# EAGLE schematic controller (EAGLE 6.5.0)
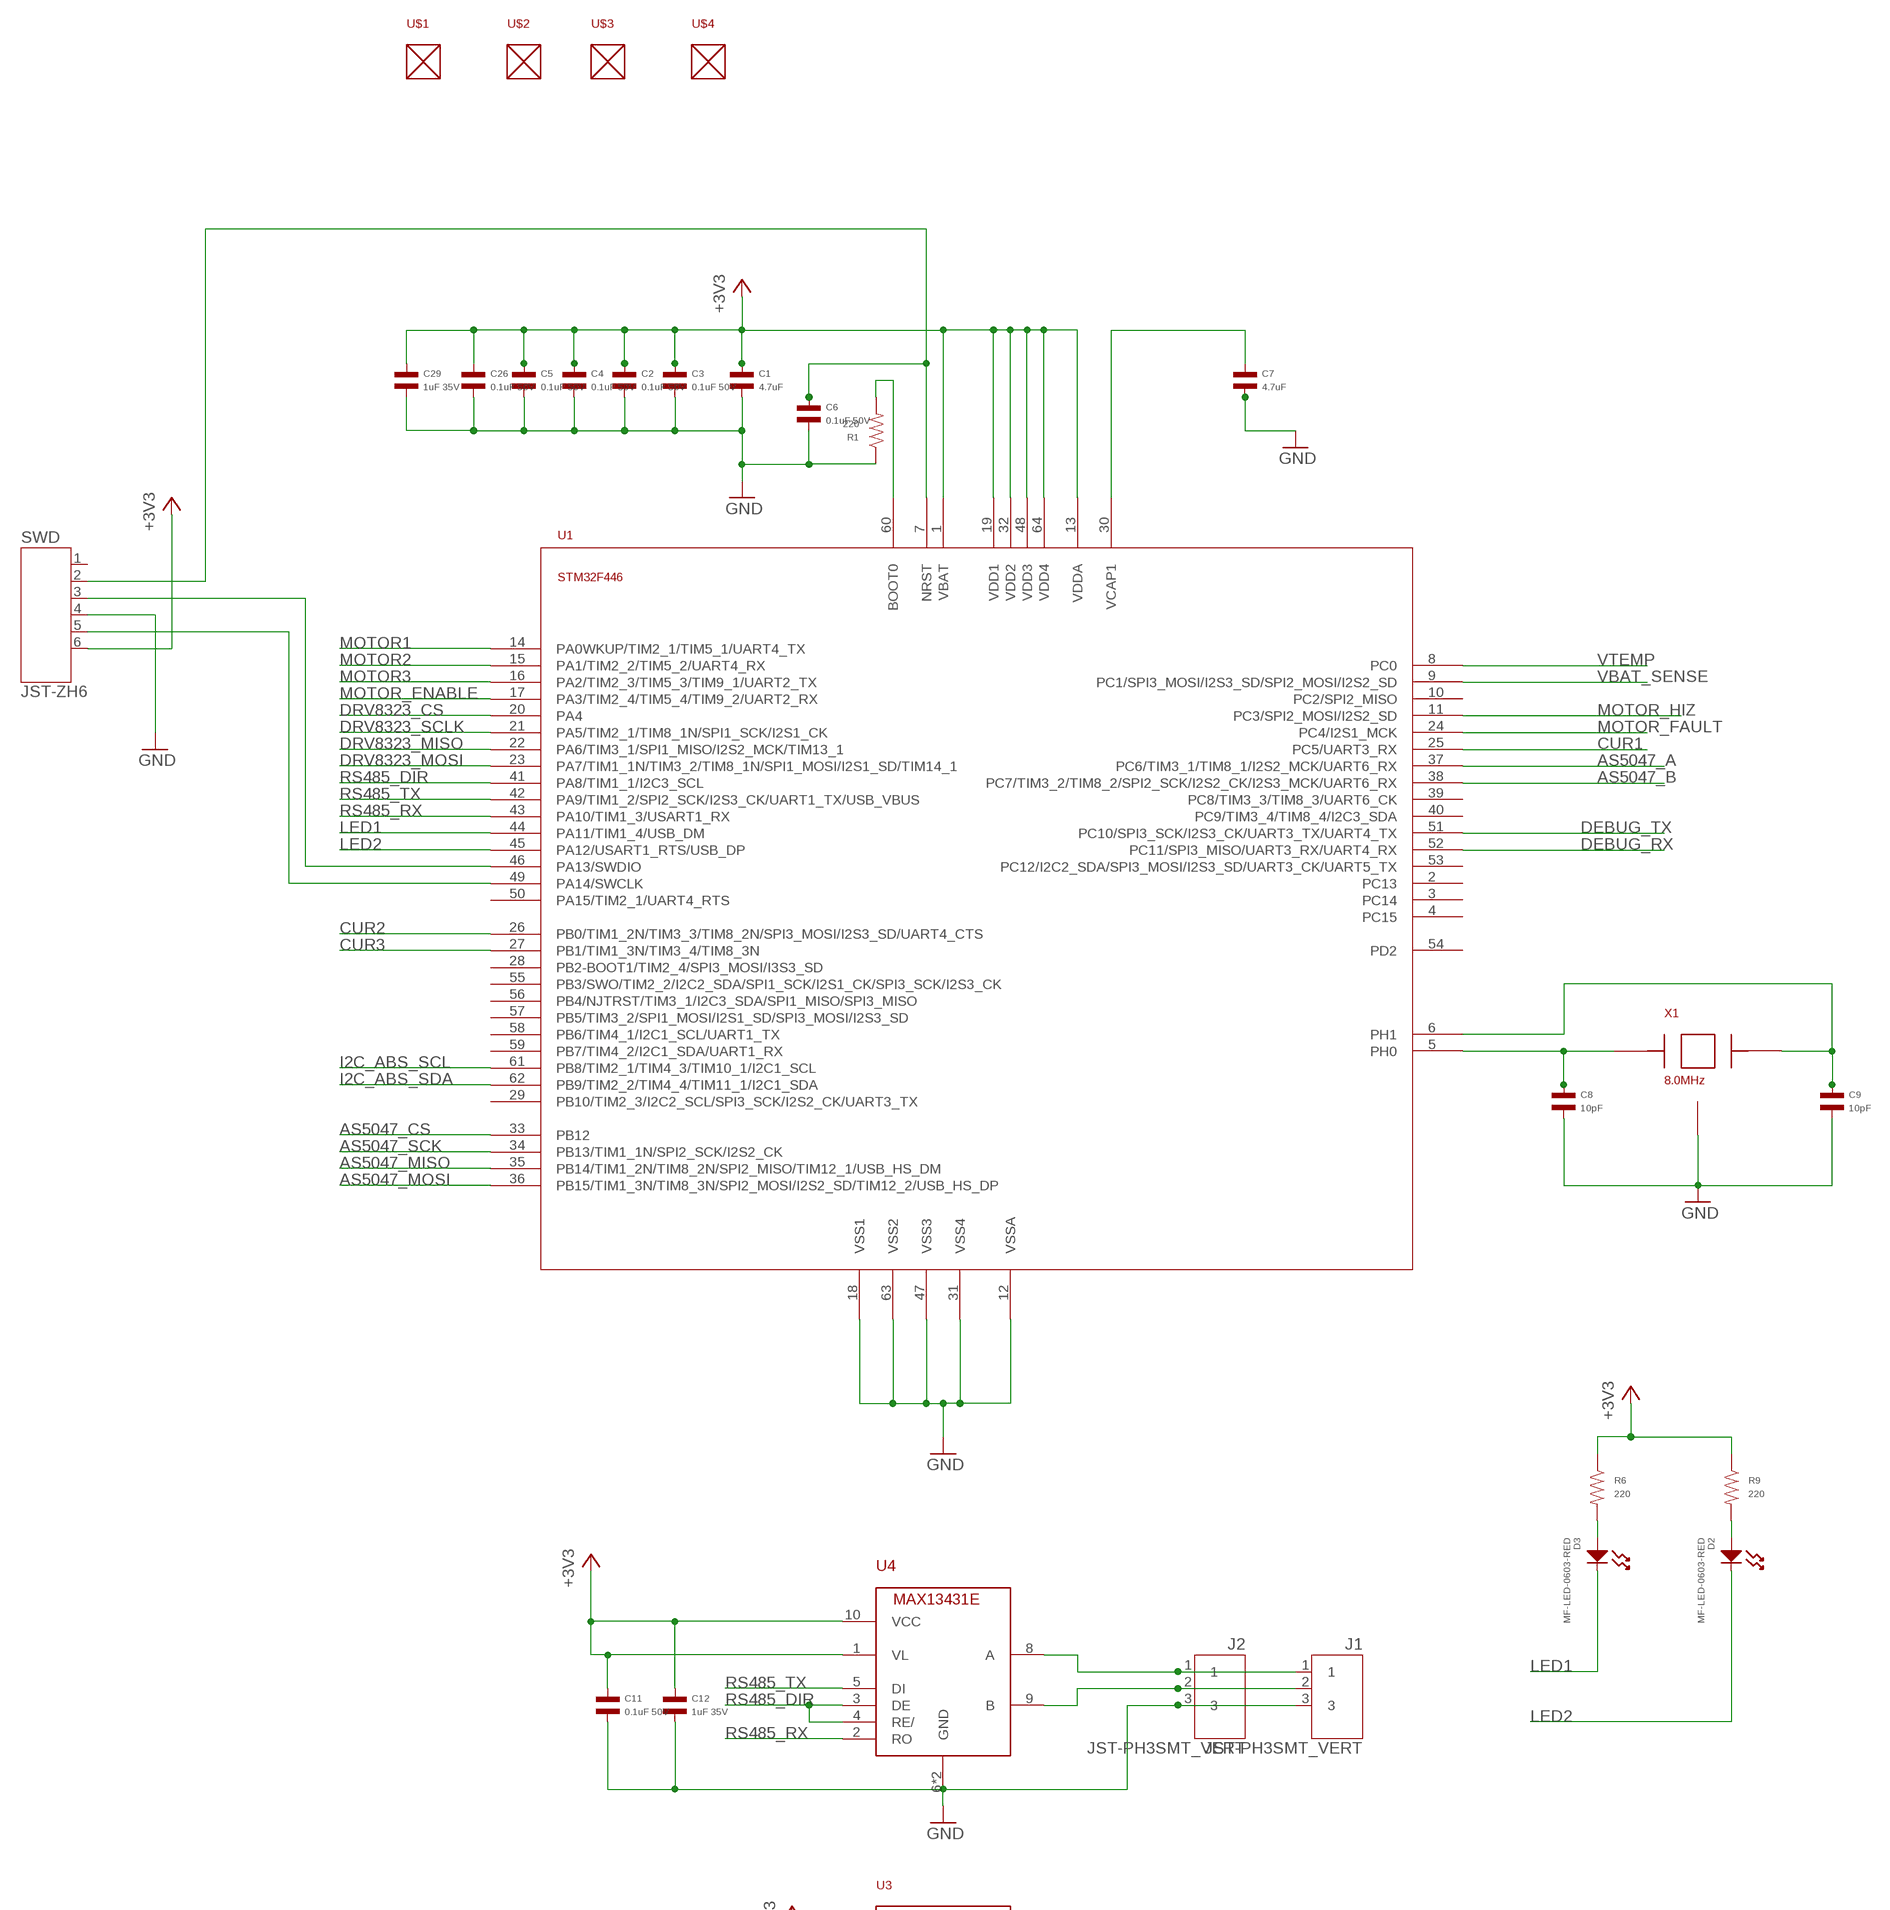
[diagram p0: schematic, sheet 1, part 1 of 2]
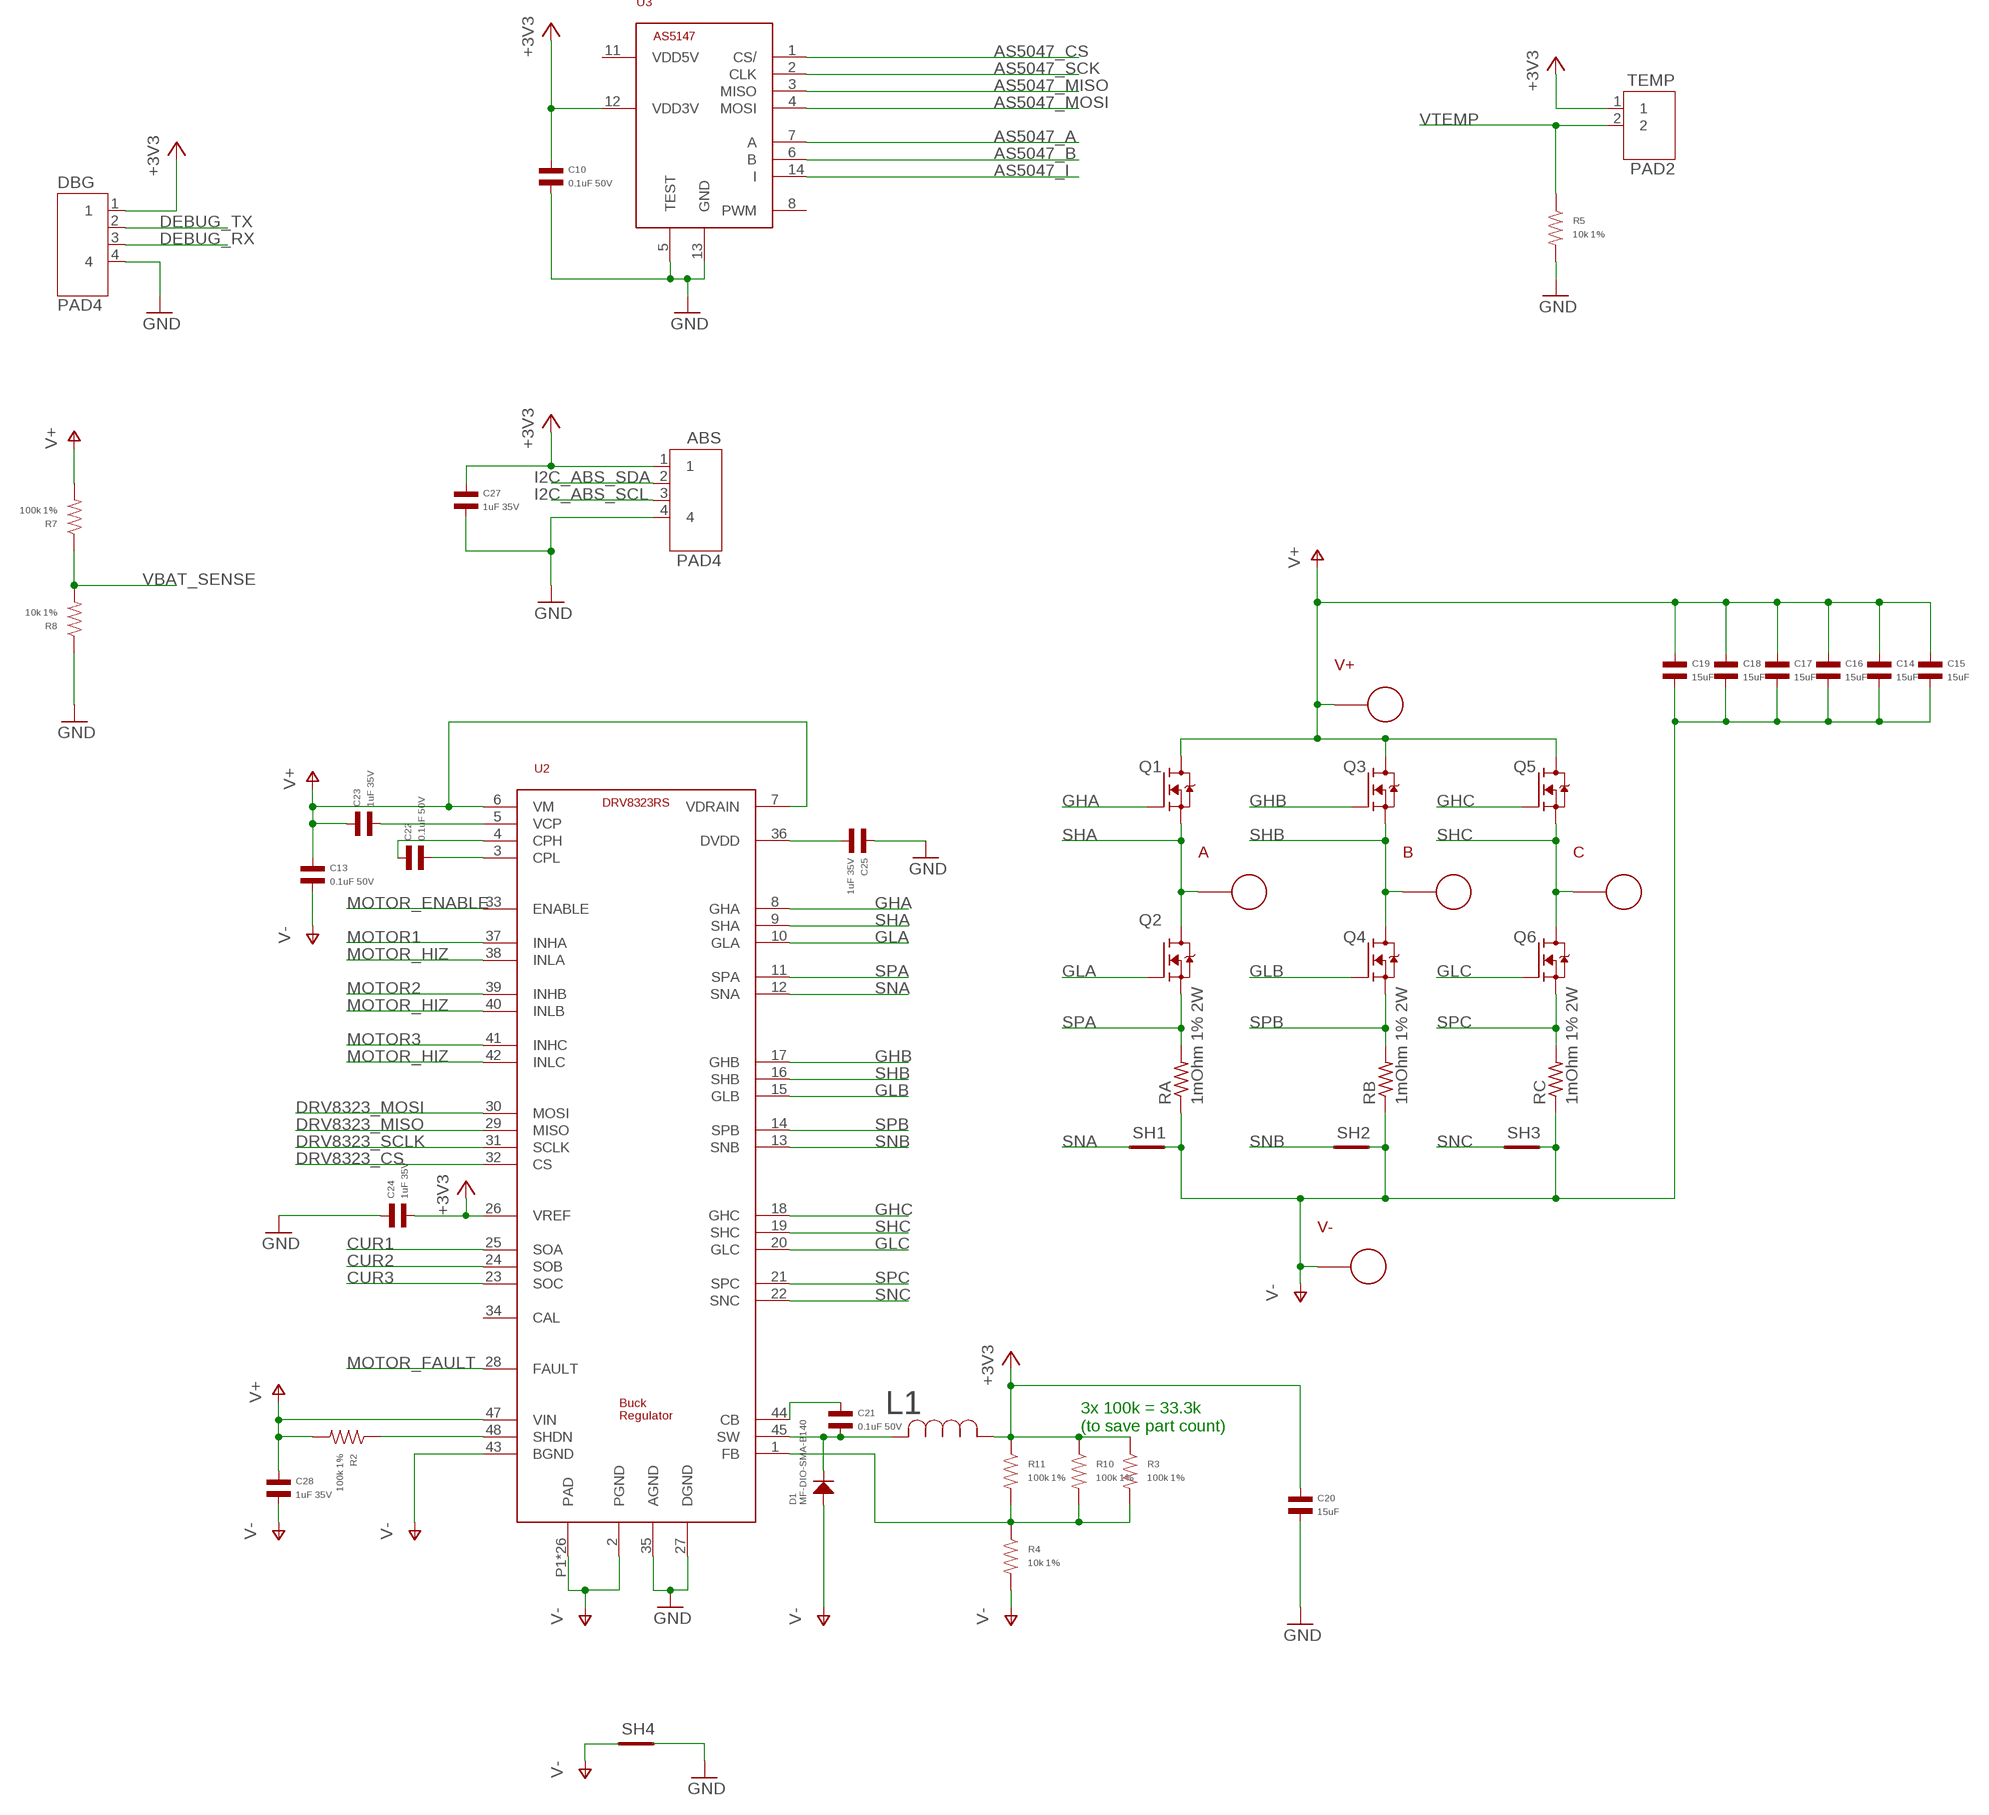
[diagram p1: schematic, sheet 1, part 2 of 2]

## Parts
A  PAD  [18AWG_PAD]
ABS  PAD4  [PAD15_4]
B  PAD  [18AWG_PAD]
C  PAD  [18AWG_PAD]
C1  4.7uF  CAPACITOR_NP_0603  [C0603]
C2  0.1uF 50V  CAPACITOR_NP_0402  [C0402]
C3  0.1uF 50V  CAPACITOR_NP_0402  [C0402]
C4  0.1uF 50V  CAPACITOR_NP_0402  [C0402]
C5  0.1uF 50V  CAPACITOR_NP_0402  [C0402]
C6  0.1uF 50V  CAPACITOR_NP_0402  [C0402]
C7  4.7uF  CAPACITOR_NP_0603  [C0603]
C8  10pF  CAPACITOR_NP_0402  [C0402]
C9  10pF  CAPACITOR_NP_0402  [C0402]
C10  0.1uF 50V  CAPACITOR_NP_0402  [C0402]
C11  0.1uF 50V  CAPACITOR_NP_0402  [C0402]
C12  1uF 35V  CAPACITOR_NP_0402  [C0402]
C13  0.1uF 50V  CAPACITOR_NP_0402  [C0402]
C14  15uF  CAPACITOR_NP_1206  [C1206]
C15  15uF  CAPACITOR_NP_1206  [C1206]
C16  15uF  CAPACITOR_NP_1206  [C1206]
C17  15uF  CAPACITOR_NP_1206  [C1206]
C18  15uF  CAPACITOR_NP_1206  [C1206]
C19  15uF  CAPACITOR_NP_1206  [C1206]
C20  15uF  CAPACITOR_NP_1206  [C1206]
C21  0.1uF 50V  CAPACITOR_NP_0402  [C0402]
C22  0.1uF 50V  CAPACITOR_NP_0402  [C0402]
C23  1uF 35V  CAPACITOR_NP_0402  [C0402]
C24  1uF 35V  CAPACITOR_NP_0402  [C0402]
C25  1uF 35V  CAPACITOR_NP_0402  [C0402]
C26  0.1uF 50V  CAPACITOR_NP_0402  [C0402]
C27  1uF 35V  CAPACITOR_NP_0402  [C0402]
C28  1uF 35V  CAPACITOR_NP_0402  [C0402]
C29  1uF 35V  CAPACITOR_NP_0402  [C0402]
D1  MF-DIO-SMA-B140  DIODES_B140_SMA  [SMA]
D2  MF-LED-0603-RED  LED_SINGLE-0603-RED  [LED0603]
D3  MF-LED-0603-RED  LED_SINGLE-0603-RED  [LED0603]
DBG  PAD4  [PAD15_4]
J1  JST-PH3SMT_VERT  [JST_B3B_PH-SM4-TB(LF)(SN)]
J2  JST-PH3SMT_VERT  [JST_B3B_PH-SM4-TB(LF)(SN)]
L1  SRN4018-220M  [IND_BOURNS_SRN4018]
Q1  TPN1R603PL  [TSON_ADVANCE_8]
Q2  TPN1R603PL  [TSON_ADVANCE_8]
Q3  TPN1R603PL  [TSON_ADVANCE_8]
Q4  TPN1R603PL  [TSON_ADVANCE_8]
Q5  TPN1R603PL  [TSON_ADVANCE_8]
Q6  TPN1R603PL  [TSON_ADVANCE_8]
R1  220  RESISTOR_0402  [R0402]
R2  100k 1%  RESISTOR_0402  [R0402]
R3  100k 1%  RESISTOR_0402  [R0402]
R4  10k 1%  RESISTOR_0402  [R0402]
R5  10k 1%  RESISTOR_0402  [R0402]
R6  220  RESISTOR_0402  [R0402]
R7  100k 1%  RESISTOR_0402  [R0402]
R8  10k 1%  RESISTOR_0402  [R0402]
R9  220  RESISTOR_0402  [R0402]
R10  100k 1%  RESISTOR_0402  [R0402]
R11  100k 1%  RESISTOR_0402  [R0402]
RA  1mOhm 1% 2W  R-US_M1206  [M1206]
RB  1mOhm 1% 2W  R-US_M1206  [M1206]
RC  1mOhm 1% 2W  R-US_M1206  [M1206]
SH1  SHORTT5  [SHORT_TOP-50]
SH2  SHORTT5  [SHORT_TOP-50]
SH3  SHORTT5  [SHORT_TOP-50]
SH4  SHORTBIG  [SHORT_TOP-BIG]
SWD  JST-ZH6  [JST_S6B-ZR-SM4A-TF(LF)(SN)]
TEMP  PAD2  [PAD15_2]
U1  STM32F4R_64PIN  [LQFP64]
U2  DRV8323RS  [PVQFN-N48]
U3  AS5147  [TSSOP14]
U4  MAX13431E  [TDFN10]
U$1  MOUNTM2  [M2MOUNT]
U$2  MOUNTM2  [M2MOUNT]
U$3  MOUNTM2  [M2MOUNT]
U$4  MOUNTM2  [M2MOUNT]
V+  PAD12AWG_PAD  [12AWG_PAD]
V-  PAD12AWG_PAD  [12AWG_PAD]
X1  8.0MHz  CRYSTALABM3B  [ABM3B]

## Nets
+3V3: ABS.1 C1.P$1 C2.P$1 C3.P$1 C4.P$1 C5.P$1 C10.P$1 C11.P$1 C12.P$1 C20.P$1 C24.P$2 C26.P$1 C27.P$1 C29.P$1 DBG.1 L1.1 R3.P$1 R6.P$1 R9.P$1 R10.P$1 R11.P$1 SWD.6 TEMP.1 U1.1(VBAT) U1.13(VDDA) U1.19(VDD1) U1.32(VDD2) U1.48(VDD3) U1.64(VDD4) U2.26(VREF) U3.12(VDD3V) U4.1(VL) U4.10(VCC)
AS5047_A: U1.37(PC6/TIM3_1/TIM8_1/I2S2_MCK/UART6_RX) U3.7(A)
AS5047_B: U1.38(PC7/TIM3_2/TIM8_2/SPI2_SCK/I2S2_CK/I2S3_MCK/UART6_RX) U3.6(B)
AS5047_CS: U1.33(PB12) U3.1(CS/)
AS5047_I: U3.14(I)
AS5047_MISO: U1.35(PB14/TIM1_2N/TIM8_2N/SPI2_MISO/TIM12_1/USB_HS_DM) U3.3(MISO)
AS5047_MOSI: U1.36(PB15/TIM1_3N/TIM8_3N/SPI2_MOSI/I2S2_SD/TIM12_2/USB_HS_DP) U3.4(MOSI)
AS5047_SCK: U1.34(PB13/TIM1_1N/SPI2_SCK/I2S2_CK) U3.2(CLK)
CUR1: U1.25(PC5/UART3_RX) U2.25(SOA)
CUR2: U1.26(PB0/TIM1_2N/TIM3_3/TIM8_2N/SPI3_MOSI/I2S3_SD/UART4_CTS) U2.24(SOB)
CUR3: U1.27(PB1/TIM1_3N/TIM3_4/TIM8_3N) U2.23(SOC)
DEBUG_RX: DBG.3 U1.52(PC11/SPI3_MISO/UART3_RX/UART4_RX)
DEBUG_TX: DBG.2 U1.51(PC10/SPI3_SCK/I2S3_CK/UART3_TX/UART4_TX)
DRV8323_CS: U1.20(PA4) U2.32(CS)
DRV8323_MISO: U1.22(PA6/TIM3_1/SPI1_MISO/I2S2_MCK/TIM13_1) U2.29(MISO)
DRV8323_MOSI: U1.23(PA7/TIM1_1N/TIM3_2/TIM8_1N/SPI1_MOSI/I2S1_SD/TIM14_1) U2.30(MOSI)
DRV8323_SCLK: U1.21(PA5/TIM2_1/TIM8_1N/SPI1_SCK/I2S1_CK) U2.31(SCLK)
GHA: Q1.4(G) U2.8(GHA)
GHB: Q3.4(G) U2.17(GHB)
GHC: Q5.4(G) U2.18(GHC)
GLA: Q2.4(G) U2.10(GLA)
GLB: Q4.4(G) U2.15(GLB)
GLC: Q6.4(G) U2.20(GLC)
GND: ABS.4 C1.P$2 C2.P$2 C3.P$2 C4.P$2 C5.P$2 C6.P$2 C7.P$2 C8.P$2 C9.P$2 C10.P$2 C11.P$2 C12.P$2 C20.P$2 C24.P$1 C25.P$1 C26.P$2 C27.P$2 C29.P$2 DBG.4 J1.3 J2.3 R1.P$1 R5.P$2 R8.P$1 SH4.2 SWD.4 U1.12(VSSA) U1.18(VSS1) U1.31(VSS4) U1.47(VSS3) U1.63(VSS2) U2.27(DGND) U2.35(AGND) U3.5(TEST) U3.13(GND) U4.6(GND) U4.PAD(GND) X1.2 X1.4
I2C_ABS_SCL: ABS.3 U1.61(PB8/TIM2_1/TIM4_3/TIM10_1/I2C1_SCL)
I2C_ABS_SDA: ABS.2 U1.62(PB9/TIM2_2/TIM4_4/TIM11_1/I2C1_SDA)
LED1: D3.CATHODE U1.44(PA11/TIM1_4/USB_DM)
LED2: D2.CATHODE U1.45(PA12/USART1_RTS/USB_DP)
MOTOR1: U1.14(PA0WKUP/TIM2_1/TIM5_1/UART4_TX) U2.37(INHA)
MOTOR2: U1.15(PA1/TIM2_2/TIM5_2/UART4_RX) U2.39(INHB)
MOTOR3: U1.16(PA2/TIM2_3/TIM5_3/TIM9_1/UART2_TX) U2.41(INHC)
MOTOR_ENABLE: U1.17(PA3/TIM2_4/TIM5_4/TIM9_2/UART2_RX) U2.33(ENABLE)
MOTOR_FAULT: U1.24(PC4/I2S1_MCK) U2.28(FAULT)
MOTOR_HIZ: U1.11(PC3/SPI2_MOSI/I2S2_SD) U2.38(INLA) U2.40(INLB) U2.42(INLC)
N$5: R2.P$1 U2.48(SHDN)
N$6: SWD.5 U1.49(PA14/SWCLK)
N$7: SWD.3 U1.46(PA13/SWDIO)
N$8: R3.P$2 R4.P$1 R10.P$2 R11.P$2 U2.1(FB)
N$9: J1.2 J2.2 U4.9(B)
N$10: C22.P$2 U2.3(CPL)
N$11: C21.P$2 D1.CATHODE L1.2 U2.45(SW)
N$12: C21.P$1 U2.44(CB)
N$13: C22.P$1 U2.4(CPH)
N$14: C23.P$2 U2.5(VCP)
N$15: J1.1 J2.1 U4.8(A)
N$16: C25.P$2 U2.36(DVDD)
N$17: D3.ANODE R6.P$2
N$18: D2.ANODE R9.P$2
N$23: C7.P$1 U1.30(VCAP1)
N$24: C6.P$1 SWD.2 U1.7(NRST)
N$33: R1.P$2 U1.60(BOOT0)
N$35: C8.P$1 U1.5(PH0) X1.1
N$36: C9.P$1 U1.6(PH1) X1.3
RS485_DIR: U1.41(PA8/TIM1_1/I2C3_SCL) U4.3(DE) U4.4(RE/)
RS485_RX: U1.43(PA10/TIM1_3/USART1_RX) U4.2(RO)
RS485_TX: U1.42(PA9/TIM1_2/SPI2_SCK/I2S3_CK/UART1_TX/USB_VBUS) U4.5(DI)
SHA: A.1 Q1.1(S) Q1.2(S) Q1.3(S) Q2.5(D) Q2.6(D) Q2.7(D) Q2.8(D) Q2.PAD(D) U2.9(SHA)
SHB: B.1 Q3.1(S) Q3.2(S) Q3.3(S) Q4.5(D) Q4.6(D) Q4.7(D) Q4.8(D) Q4.PAD(D) U2.16(SHB)
SHC: C.1 Q5.1(S) Q5.2(S) Q5.3(S) Q6.5(D) Q6.6(D) Q6.7(D) Q6.8(D) Q6.PAD(D) U2.19(SHC)
SNA: SH1.1 U2.12(SNA)
SNB: SH2.1 U2.13(SNB)
SNC: SH3.1 U2.22(SNC)
SPA: Q2.1(S) Q2.2(S) Q2.3(S) RA.2 U2.11(SPA)
SPB: Q4.1(S) Q4.2(S) Q4.3(S) RB.2 U2.14(SPB)
SPC: Q6.1(S) Q6.2(S) Q6.3(S) RC.2 U2.21(SPC)
V+: C13.P$1 C14.P$1 C15.P$1 C16.P$1 C17.P$1 C18.P$1 C19.P$1 C23.P$1 C28.P$1 Q1.5(D) Q1.6(D) Q1.7(D) Q1.8(D) Q1.PAD(D) Q3.5(D) Q3.6(D) Q3.7(D) Q3.8(D) Q3.PAD(D) Q5.5(D) Q5.6(D) Q5.7(D) Q5.8(D) Q5.PAD(D) R2.P$2 R7.P$2 U2.6(VM) U2.7(VDRAIN) U2.47(VIN) V+.1
V-: C13.P$2 C14.P$2 C15.P$2 C16.P$2 C17.P$2 C18.P$2 C19.P$2 C28.P$2 D1.ANODE R4.P$2 RA.1 RB.1 RC.1 SH1.2 SH2.2 SH3.2 SH4.1 U2.2(PGND) U2.43(BGND) U2.P1(PAD) U2.P2(PAD) U2.P3(PAD) U2.P4(PAD) U2.P5(PAD) U2.P6(PAD) U2.P7(PAD) U2.P8(PAD) U2.P9(PAD) U2.P10(PAD) U2.P11(PAD) U2.P12(PAD) U2.P13(PAD) U2.P14(PAD) U2.P15(PAD) U2.P16(PAD) U2.P17(PAD) U2.P18(PAD) U2.P19(PAD) U2.P20(PAD) U2.P21(PAD) U2.P22(PAD) U2.P23(PAD) U2.P24(PAD) U2.P25(PAD) U2.PAD V-.1
VBAT_SENSE: R7.P$1 R8.P$2 U1.9(PC1/SPI3_MOSI/I2S3_SD/SPI2_MOSI/I2S2_SD)
VTEMP: R5.P$1 TEMP.2 U1.8(PC0)
Unconnected: SWD.1 U1.2(PC13) U1.3(PC14) U1.4(PC15) U1.10(PC2/SPI2_MISO) U1.28(PB2-BOOT1/TIM2_4/SPI3_MOSI/I3S3_SD) U1.29(PB10/TIM2_3/I2C2_SCL/SPI3_SCK/I2S2_CK/UART3_TX) U1.39(PC8/TIM3_3/TIM8_3/UART6_CK) U1.40(PC9/TIM3_4/TIM8_4/I2C3_SDA) U1.50(PA15/TIM2_1/UART4_RTS) U1.53(PC12/I2C2_SDA/SPI3_MOSI/I2S3_SD/UART3_CK/UART5_TX) U1.54(PD2) U1.55(PB3/SWO/TIM2_2/I2C2_SDA/SPI1_SCK/I2S1_CK/SPI3_SCK/I2S3_CK) U1.56(PB4/NJTRST/TIM3_1/I2C3_SDA/SPI1_MISO/SPI3_MISO) U1.57(PB5/TIM3_2/SPI1_MOSI/I2S1_SD/SPI3_MOSI/I2S3_SD) U1.58(PB6/TIM4_1/I2C1_SCL/UART1_TX) U1.59(PB7/TIM4_2/I2C1_SDA/UART1_RX) U2.34(CAL) U3.8(PWM) U3.11(VDD5V)

## Notes on the sheet
- 3x 100k = 33.3k
  (to save part count)

## Library data of the parts
A B C V+ V- = controller:PAD; POPULATE: 0
ABS DBG = controller:PAD4; POPULATE: 0
C1 C7 = mfpassives:CAPACITOR_NP: Library: MF_Passives Description: Device for Non-Polarized Capacitors. Manufacture part number (MPN) can be added via Attributes. Check https://factory.macrofab.com/parts for the house parts list.; MF: Samsung Electro-Mechanics; MPN: CL10A475MP8NNNC; POPULATE: 1
C2-C6 C10 C11 C13 C21 C22 C26 = mfpassives:CAPACITOR_NP: Library: MF_Passives Description: Device for Non-Polarized Capacitors. Manufacture part number (MPN) can be added via Attributes. Check https://factory.macrofab.com/parts for the house parts list.; MF: TDK; MPN: C1005X7R1H104K050BE; POPULATE: 1
C8 C9 = mfpassives:CAPACITOR_NP: Library: MF_Passives Description: Device for Non-Polarized Capacitors. Manufacture part number (MPN) can be added via Attributes. Check https://factory.macrofab.com/parts for the house parts list.; MF: Samsung Electro-Mechanics; MPN: CL05C100JB51PNC; POPULATE: 1
C12 C23-C25 C27-C29 = mfpassives:CAPACITOR_NP: Library: MF_Passives Description: Device for Non-Polarized Capacitors. Manufacture part number (MPN) can be added via Attributes. Check https://factory.macrofab.com/parts for the house parts list.; MF: Samsung Electro-Mechanics; MPN: CL05A105KL5NRNC; POPULATE: 1
C14-C20 = mfpassives:CAPACITOR_NP: Library: MF_Passives Description: Device for Non-Polarized Capacitors. Manufacture part number (MPN) can be added via Attributes. Check https://factory.macrofab.com/parts for the house parts list.; MF: TDK; MPN: C3216X5R1V156M160AC; POPULATE: 1
D1 = mfdiscretesemi:DIODES: Library: MF_Discrete_Semiconductor Description: Device for Single Packaged Diodes.; HOUSEPART: YES; MPN: MF-DIO-SMA-B140; POPULATE: 1; URL: https://factory.macrofab.com/part/MF-DIO-SMA-B140
D2 D3 = mfleds:LED_SINGLE: Library: MF_LEDs Description: Device for Single LED Packages. Manufacture part number (MFG#) can be added via Attributes.; HOUSEPART: YES; MPN: MF-LED-0603-RED; POPULATE: 1; URL: https://factory.macrofab.com/part/MF-LED-0603-RED
J1 J2 = controller:JST-PH3; MF: JST; MPN: B3B-PH-SM4-TB(LF)(SN); POPULATE: 1
L1 = controller:SRN4018-220M; MANUFACTURER_PART_NUMBER: SRN4018220M; MPN: SRN4018-220M; POPULATE: 1; VENDOR: Bourns Electronics
Q1-Q6 = controller:TPN1R603PL; MF: Toshiba; MPN: TPN1R603PL,L1Q; POPULATE: 1
R1 R6 R9 = mfpassives:RESISTOR: Library: MF_Passives Description: Device for Resistors. Manufacture part number (MPN), Voltage, Tolerance, and Wattage Rating can be added via Attributes. Check https://factory.macrofab.com/parts for the house parts list.; HOUSEPART: 1; MPN: MF-RES-0402-220; POPULATE: 1
R2 R3 R7 R10 R11 = mfpassives:RESISTOR: Library: MF_Passives Description: Device for Resistors. Manufacture part number (MPN), Voltage, Tolerance, and Wattage Rating can be added via Attributes. Check https://factory.macrofab.com/parts for the house parts list.; MF: Panasonic; MPN: ERJ-2RKF1003X; POPULATE: 1
R4 R5 R8 = mfpassives:RESISTOR: Library: MF_Passives Description: Device for Resistors. Manufacture part number (MPN), Voltage, Tolerance, and Wattage Rating can be added via Attributes. Check https://factory.macrofab.com/parts for the house parts list.; MF: Panasonic; MPN: ERJ-2RKF1002X; POPULATE: 1
RA RB RC = rcl:R-US_: RESISTOR, American symbol; MF: Stackpole Electronics; MPN: HCS1206FT1L00; POPULATE: 1
SH1-SH3 = shorts:SHORT: Short between two nets; BOM: no; POPULATE: 0
SH4 = shorts:SHORT: Short between two nets; POPULATE: 0
SWD = controller:JST-ZH6; MF: JST; MPN: S6B-ZR-SM4A-TF(LF)(SN); POPULATE: 1
TEMP = controller:PAD2; POPULATE: 0
U1 = controller:STM32F4R_64PIN: 64-pin STM32F4 chip.; MF: ST; MPN: STM32F446RET6; POPULATE: 1
U2 = controller:DRV8323RS; MF: TI; MPN: DRV8323RSRGZR; POPULATE: 1
U3 = controller:AS5147; MF: AMS; MPN: AS5047P-ATSM; POPULATE: 1
U4 = controller:MAX13431E; MF: Maxim; MPN: MAX13431EETB+T; POPULATE: 1
U$1-U$4 = controller:MOUNT; POPULATE: 0
X1 = controller:CRYSTAL; MF: Abracon; MPN: ABM3B-8.000MHZ-10-1-U-T; POPULATE: 1